# EAGLE design iblock-breadboard (EAGLE 7.6.0)
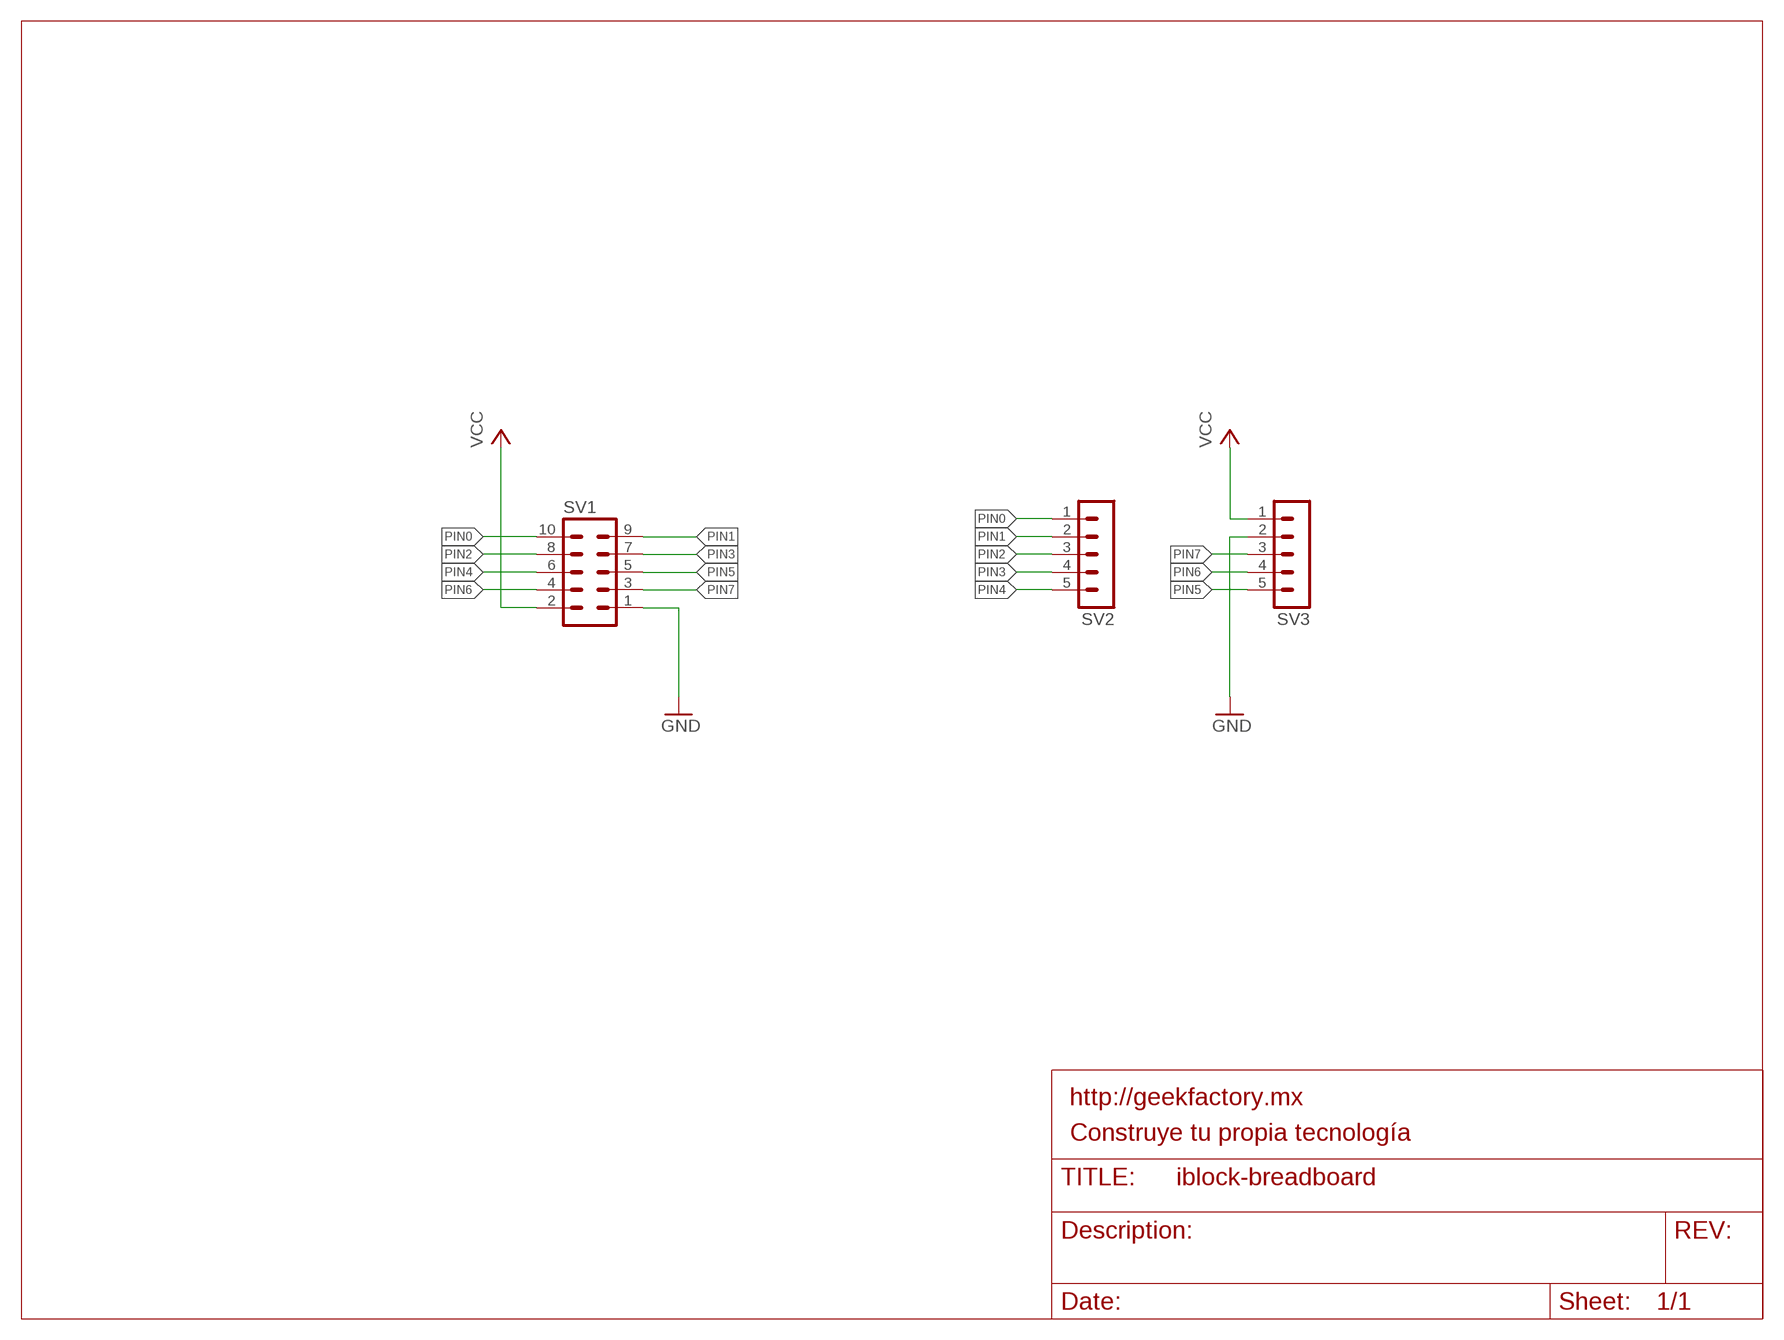
[diagram p0: schematic, sheet 1]

## Parts
SV1  MA05-2  [MA05-2]
SV2  MA05-1  [MA05-1]
SV3  MA05-1  [MA05-1]

## Nets
GND: SV1.1 SV3.2
PIN0: SV1.10 SV2.1
PIN1: SV1.9 SV2.2
PIN2: SV1.8 SV2.3
PIN3: SV1.7 SV2.4
PIN4: SV1.6 SV2.5
PIN5: SV1.5 SV3.5
PIN6: SV1.4 SV3.4
PIN7: SV1.3 SV3.3
VCC: SV1.2 SV3.1

## Library data of the parts
SV1 = con-lstb:MA05-2: PIN HEADER; OC_FARNELL: unknown; OC_NEWARK: unknown
SV2 SV3 = con-lstb:MA05-1: PIN HEADER; OC_FARNELL: unknown; OC_NEWARK: unknown

## Board
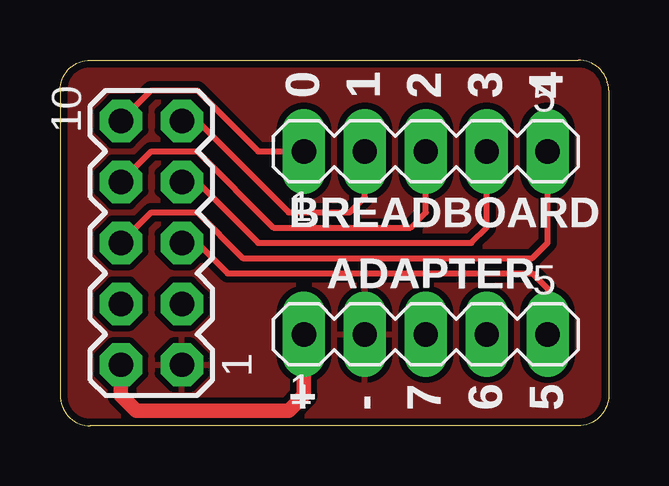
[diagram p1: board, top side]
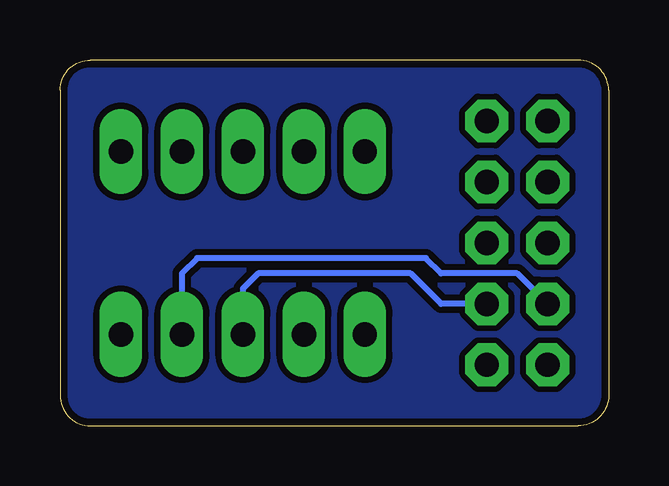
[diagram p2: board, bottom side, seen from below]

Size 22.86 x 15.24 mm. Coordinates in mm from the lower left corner, seen from the top.
Outline: 0,13.97 0,1.27 arc90 1.27,0 21.59,0 arc90 22.86,1.27 22.86,13.97 arc90 21.59,15.24 1.27,15.24 arc90 0,13.97
Copper layers (1*16): Top 0.035mm / dielectric 1.5mm / Bottom 0.035mm
Design rules "10mil_generic *": minimum track width 10mil, minimum drill 24mil, track to track 10mil, track to pad 10mil, pad to pad 10mil, via to via 10mil, smd to smd 10mil, copper to edge 12mil, drill to drill 8mil, minimum pad ring 15mil, minimum via ring 8mil, stop-mask expansion 4mil, vias tented up to drill 0mil, thermal gap 10mil

### Footprints (pad centres in the part's own frame; a part is rotated, then mirrored left to right if it is on the bottom)
MA05-2 = drill 1.016 octagon: 1 -5.08,-1.27; 2 -5.08,1.27; 3 -2.54,-1.27; 4 -2.54,1.27; 5 0,-1.27; 6 0,1.27; 7 2.54,-1.27; 8 2.54,1.27; 9 5.08,-1.27; 10 5.08,1.27
MA05-1 = drill 1.016 long: 1 -5.08,0; 2 -2.54,0; 3 0,0; 4 2.54,0; 5 5.08,0

### Placement (x,y rotation side)
SV1  3.81,7.62 90 top
SV2  15.24,11.43 0 top
SV3  15.24,3.81 0 top

### Tracks (layer width: path | path; a pad name or v marks a point on that pad's centre or on a via)
GND
  pour Top: 0,15.24 0,0 22.86,0 22.86,15.24
N$1
  pour Bottom: 0,14.61 0,0.64 0.64,0 22.23,0 22.86,0.64 22.86,14.61 22.23,15.24 0.64,15.24
PIN0
  Top 0.254: SV1.10 3.81,13.97 5.71,13.97 8.26,11.43 SV2.1
PIN1
  Top 0.254: SV1.9 5.71,12.7 9.53,8.89 12.06,8.89 12.7,9.53 SV2.2
PIN2
  Top 0.254: SV1.8 3.81,11.43 5.71,11.43 8.89,8.26 14.61,8.26 15.24,8.89 SV2.3
PIN3
  Top 0.254: SV1.7 5.71,10.16 8.26,7.62 17.14,7.62 17.78,8.26 SV2.4
PIN4
  Top 0.254: SV1.6 3.81,8.89 5.71,8.89 7.62,6.99 19.68,6.99 20.32,7.62 SV2.5
PIN5
  Top 0.254: SV1.5 5.71,7.62 6.99,6.35 19.68,6.35 20.32,5.71 SV3.5
PIN6
  Bottom 0.254: SV1.4 3.81,6.35 6.99,6.35 7.62,6.99 17.14,6.99 17.78,6.35 SV3.4
PIN7
  Bottom 0.254: SV1.3 6.99,5.08 8.26,6.35 14.61,6.35 15.24,5.71 SV3.3
VCC
  Top 0.61: SV1.2 2.54,1.27 3.17,0.64 9.53,0.64 10.16,1.27 SV3.1

### Text on the board
tPlace: 0 | 1 | 2 | 3 | 4 | BREADBOARD | ADAPTER | + | - | 7 | 6 | 5
_tsilk: 0 | 1 | 2 | 3 | 4 | BREADBOARD | ADAPTER | + | - | 7 | 6 | 5